# Altium schematic sheet SCH-Display_Sheet_1_Altium.schdoc
size 298 x 186 mm
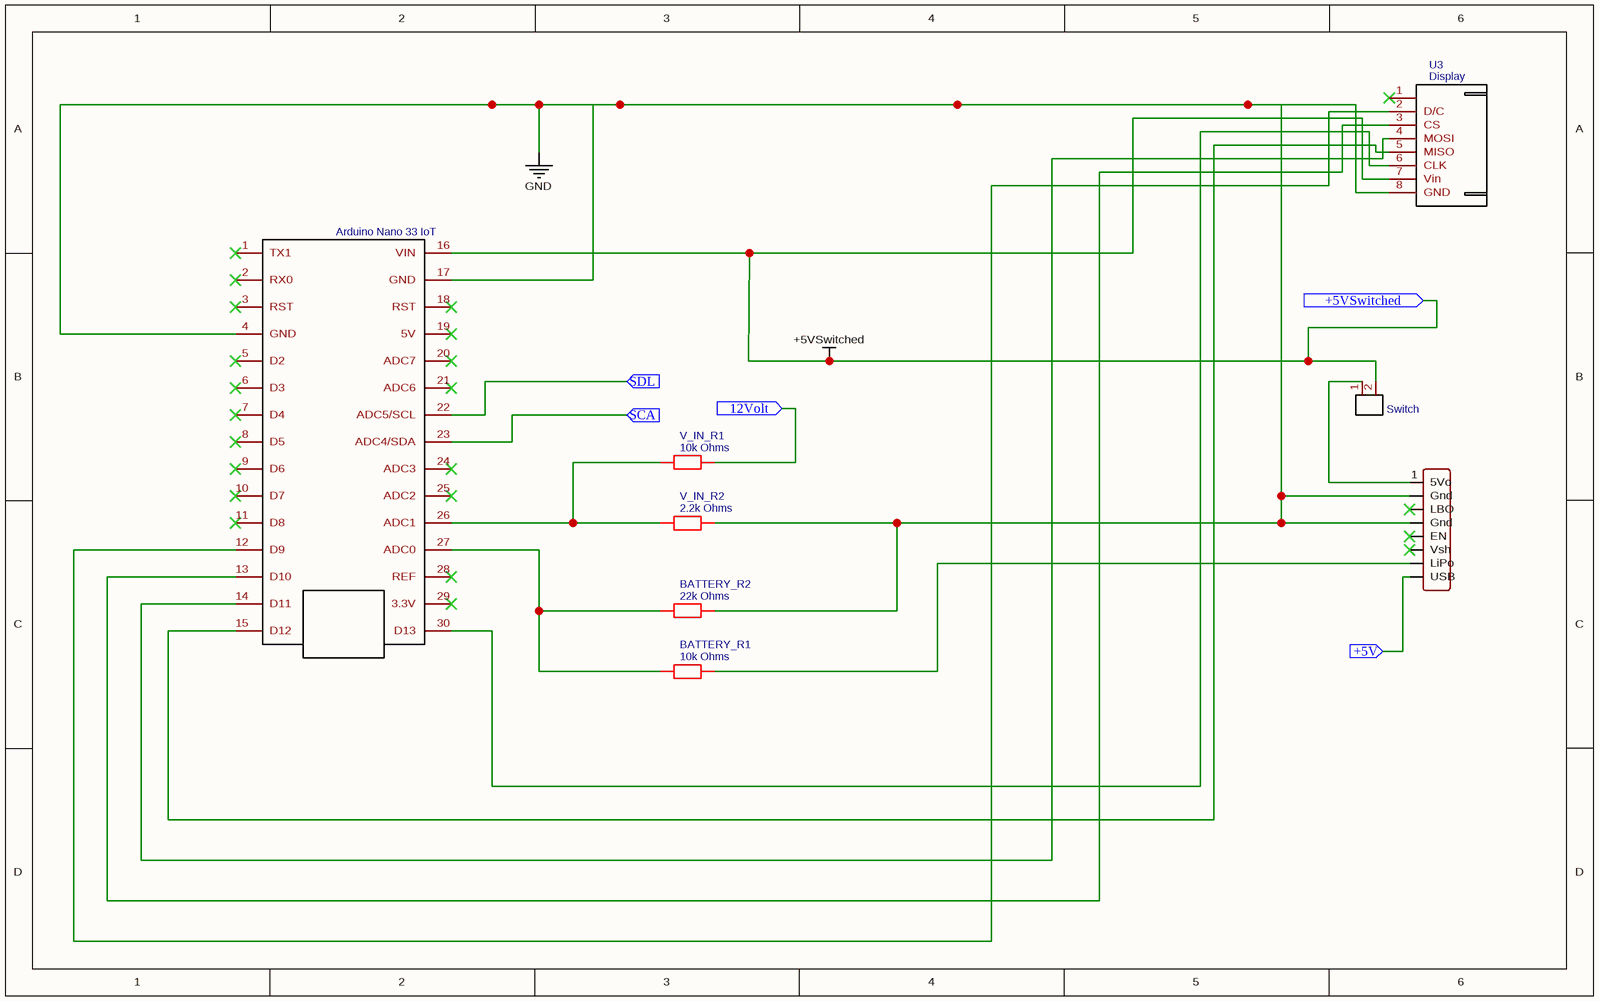
[diagram p0: SCH-Display_Sheet_1_Altium.schdoc]

## Parts
BATTERY_R1  10k Ohms  [2W RESITOR]
BATTERY_R2  22k Ohms  [2W RESITOR]
POWERBOOST  HDR-F-2.54_1x8  [HDR-F-2.54_1X8]  (value not drawn)
SWITCH  Switch  [JST-XHP-2-PIN]
U1  Arduino Nano 33 IoT  [ADUINO NANO R3]
U3  Display  [JST-XH-8-PIN]
V_IN_R1  10k Ohms  [2W RESITOR]
V_IN_R2  2.2k Ohms  [2W RESITOR]

## Ports
12Volt (in), +5V (in), +5VSwitched (in), SCA (in), SDL (in)

## Nets
+5VSwitched: SWITCH.2 U1.16(VIN) U3.7(Vin) ; port +5VSwitched
GND: BATTERY_R2.2 POWERBOOST.2(Gnd) POWERBOOST.4(Gnd) U1.4(GND) U1.17(GND) U3.8(GND) V_IN_R2.2
12Volt: V_IN_R1.2 ; port 12Volt
+5V: POWERBOOST.8(USB) ; port +5V
SCA: U1.23(ADC4/SDA) ; port SCA
SDL: U1.22(ADC5/SCL) ; port SDL
NetBATTERY_R1_1: BATTERY_R1.1 BATTERY_R2.1 U1.27(ADC0)
NetBATTERY_R1_2: BATTERY_R1.2 POWERBOOST.7(LiPo)
NetPOWERBOOST_1: POWERBOOST.1(5Vo) SWITCH.1
NetU1_12: U1.12(D9) U1.13(D10) U1.14(D11) U3.2(D/C) U3.3(CS) U3.4(MOSI)
NetU1_15: U1.15(D12) U3.5(MISO)
NetU1_26: U1.26(ADC1) V_IN_R1.1 V_IN_R2.1
NetU1_30: U1.30(D13) U3.6(CLK)

Not connected (* = marked no-connect by the designer): POWERBOOST 3(LBO)* 5(EN)* 6(Vsh)*; U1 1(TX1)* 2(RX0)* 3(RST)* 5(D2)* 6(D3)* 7(D4)* 8(D5)* 9(D6)* 10(D7)* 11(D8)* 18(RST)* 19(5V)* 20(ADC7)* 21(ADC6)* 24(ADC3)* 25(ADC2)* 28(REF)* 29(3.3V)*; U3 1*

## Library data of the parts
BATTERY_R1 V_IN_R1 = 10k Ohms: Contributor: Kagutsuchi; spicePre: R; spiceSymbolName: 1w resistor
BATTERY_R2 = 22k Ohms: Contributor: Kagutsuchi; spicePre: R; spiceSymbolName: 1w resistor
POWERBOOST = HDR-F-2.54_1x8: Contributor: LCEDA_Lib; Supplier Part: C225505; Supplier: LCSC; spicePre: H; spiceSymbolName: HDR-F-2.54_1x8
SWITCH = Switch: Contributor: Grim Reaper (C0rbac); spicePre: U; spiceSymbolName: JST-XHP-2-PIN
U1 = Arduino Nano 33 IoT: Contributor: Nikolay Yanev; spicePre: U; spiceSymbolName: ARDUINO_NANO_R3
U3 = Display: Contributor: loyboy; spicePre: U; spiceSymbolName: JST-XH-8-Pin
V_IN_R2 = 2.2k Ohms: Contributor: Kagutsuchi; spicePre: R; spiceSymbolName: 1w resistor